# Altium schematic sheet BoardInterfaces_Sergeant.SchDoc
size Tabloid; SheetNumber: 2; SheetTotal: 6
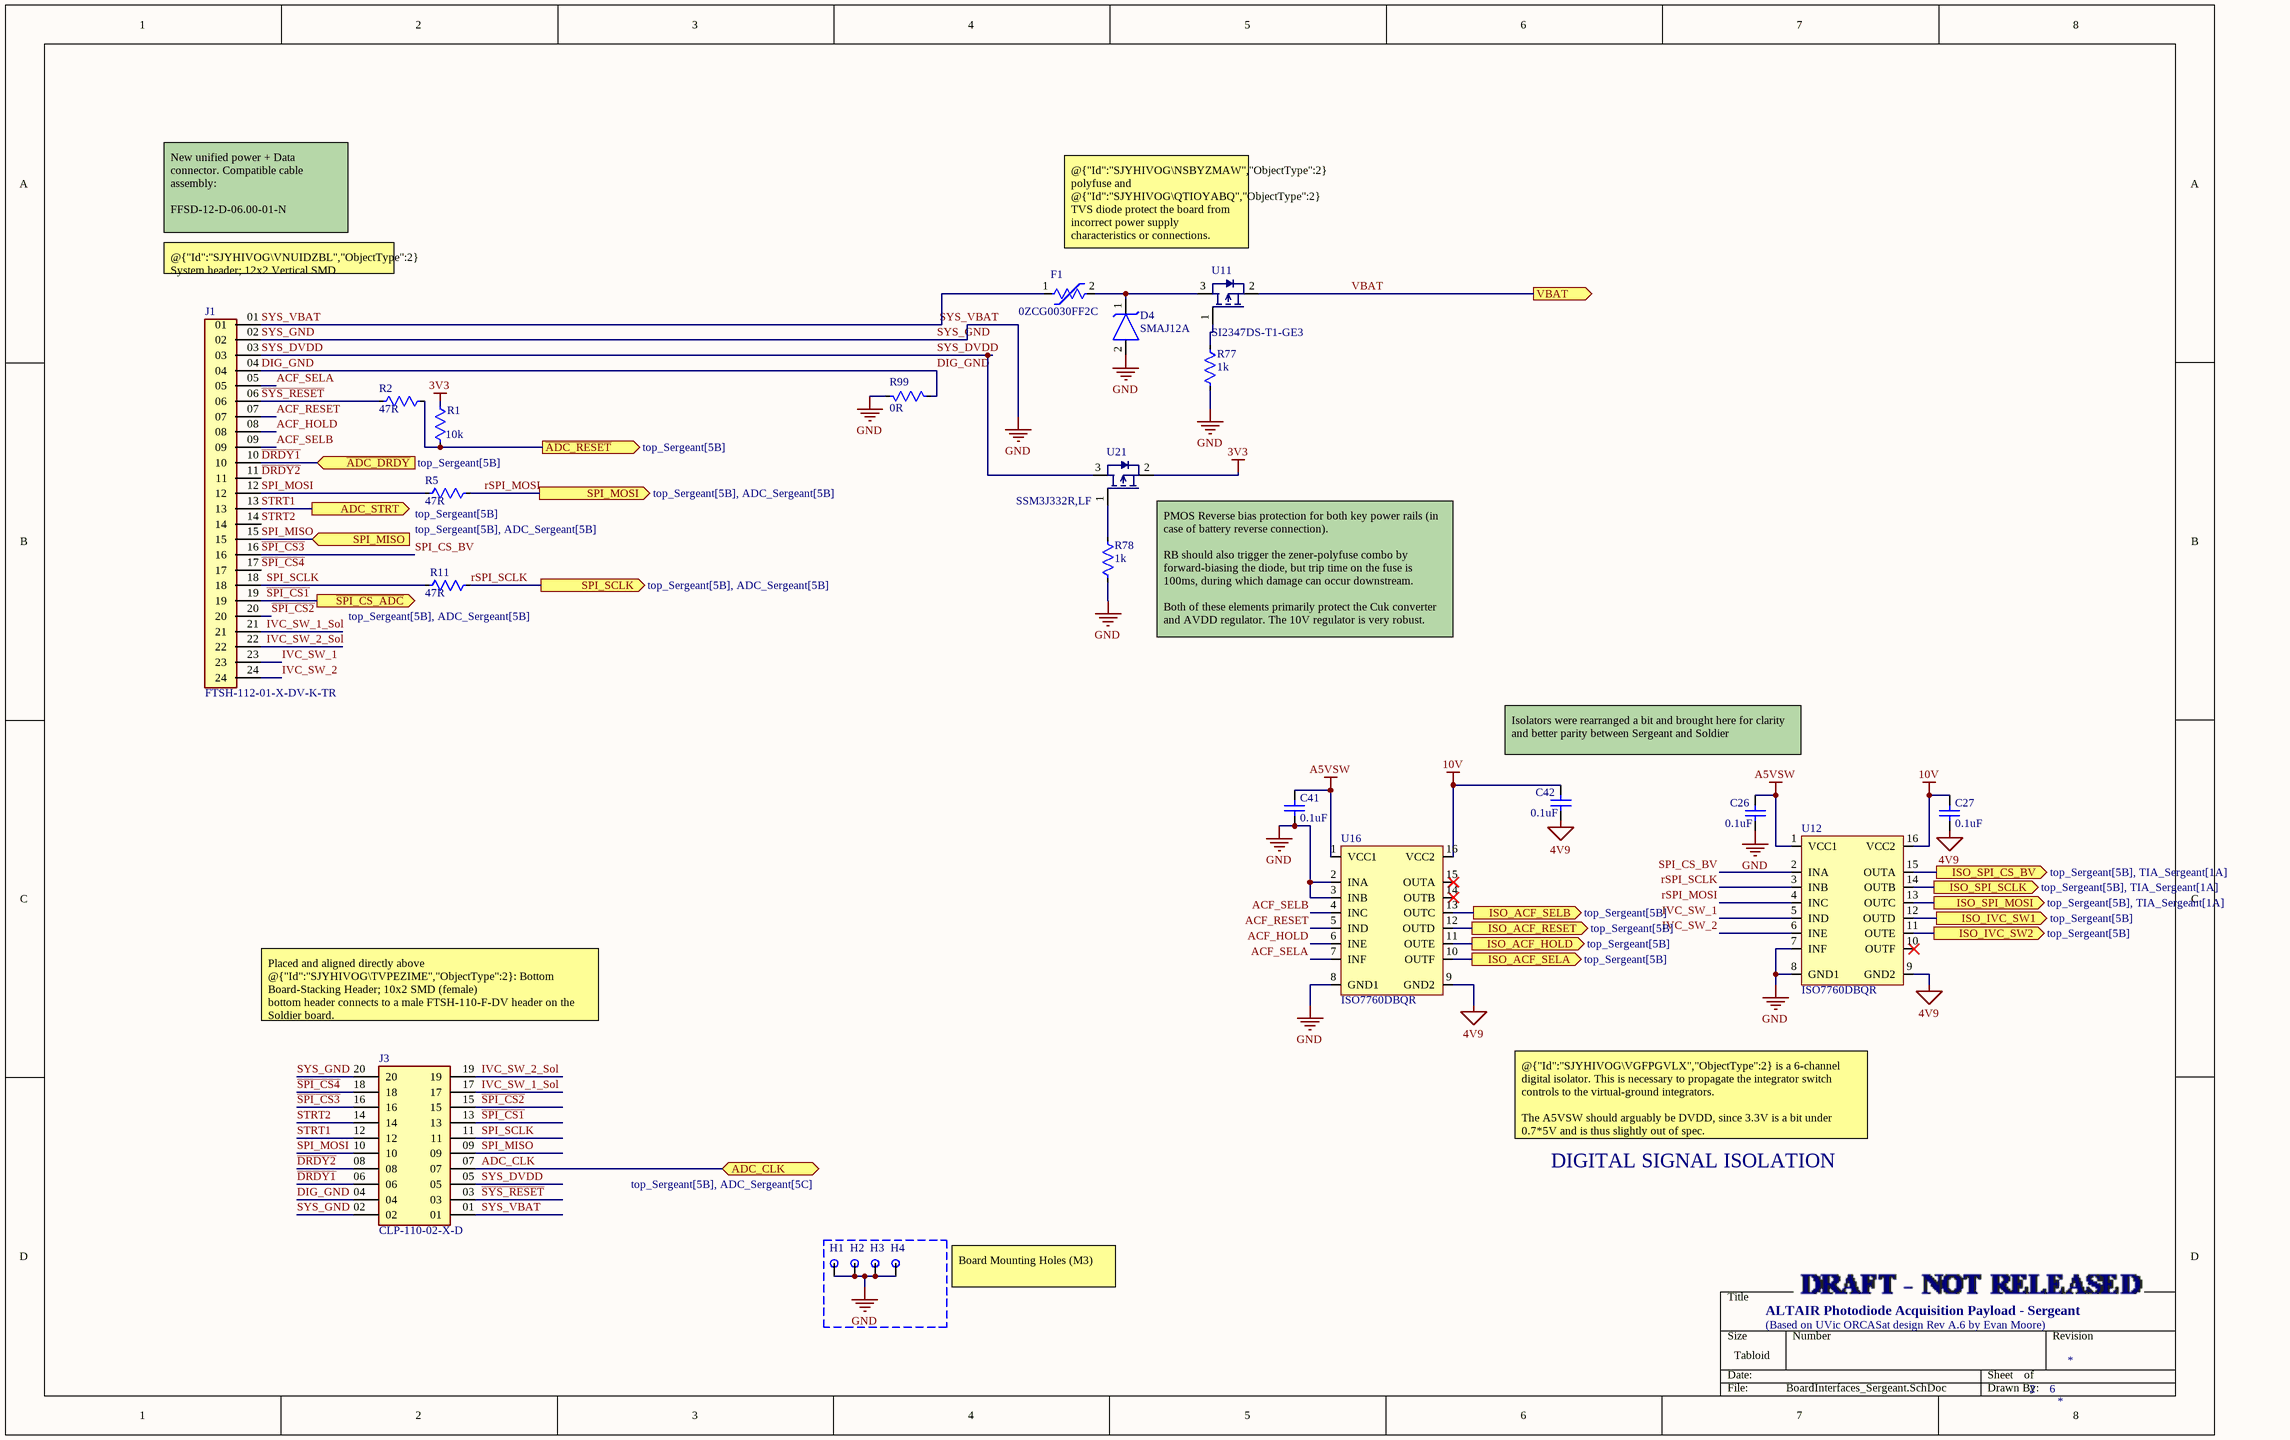
[diagram p0: BoardInterfaces_Sergeant.SchDoc]

## Parts
C26  0.1uF  [CAP 0603 IPC MID DENSITY]
C27  0.1uF  [CAP 0603 IPC MID DENSITY]
C41  0.1uF  [CAP 0603 IPC MID DENSITY]
C42  0.1uF  [CAP 0603 IPC MID DENSITY]
D4  SMAJ12A  [DO-214AC SMA VISHAY]
F1  0ZCG0030FF2C  [POLYFUSE 1812 NON-IPC BELFUSE]
H1  Mount-hole  [M3 PTH FOR 4.5MM HEX]  (value not drawn)  (no BOM)
H2  Mount-hole  [M3 PTH FOR 4.5MM HEX]  (value not drawn)  (no BOM)
H3  Mount-hole  [M3 PTH FOR 4.5MM HEX]  (value not drawn)  (no BOM)
H4  Mount-hole  [M3 PTH FOR 4.5MM HEX]  (value not drawn)  (no BOM)
J1  FTSH-112-01-X-DV-K-TR  [SAMTEC_FTSH-112-01-X-DV-K-TR]
J3  CLP-110-02-X-D  [HEADER FEMALE 10X2 1.27MM PITCH SMD]
R1  10k  [RES 0603 IPC MID DENSITY]
R2  47R  [RES 0402 NON-IPC SEI]
R5  47R  [RES 0402 NON-IPC SEI]
R11  47R  [RES 0402 NON-IPC SEI]
R77  1k  [RES 0603 IPC MID DENSITY]
R78  1k  [RES 0603 IPC MID DENSITY]
R99  0R  [RES 0402 IPC MID DENSITY]
U11  SI2347DS-T1-GE3  [SOT95P245X110-3N]
U12  ISO7760DBQR  [16-SSOP 0.635MM PITCH 5.4MM WIDTH NON-IPC TI]
U16  ISO7760DBQR  [16-SSOP 0.635MM PITCH 5.4MM WIDTH NON-IPC TI]
U21  SSM3J332R,LF  [SOT95P245X110-3N]

## Ports
ADC_CLK (bidir, see top_Sergeant[5B], ADC_Sergeant[5C]), ADC_STRT (out, see top_Sergeant[5B]), ISO_ACF_HOLD (out, see top_Sergeant[5B]), ISO_ACF_RESET (out, see top_Sergeant[5B]), ISO_ACF_SELA (out, see top_Sergeant[5B]), ISO_ACF_SELB (out, see top_Sergeant[5B]), ISO_IVC_SW1 (out, see top_Sergeant[5B]), ISO_IVC_SW2 (out, see top_Sergeant[5B]), ISO_SPI_CS_BV (out, see top_Sergeant[5B], TIA_Sergeant[1A]), ISO_SPI_MOSI (out, see top_Sergeant[5B], TIA_Sergeant[1A]), ISO_SPI_SCLK (out, see top_Sergeant[5B], TIA_Sergeant[1A]), SPI_MISO (in, see top_Sergeant[5B], ADC_Sergeant[5B]), SPI_MOSI (out, see top_Sergeant[5B], ADC_Sergeant[5B]), SPI_SCLK (out, see top_Sergeant[5B], ADC_Sergeant[5B]), VBAT (out), ~{ADC_DRDY} (in, see top_Sergeant[5B]), ~{ADC_RESET} (out, see top_Sergeant[5B]), ~{SPI_CS_ADC} (out, see top_Sergeant[5B], ADC_Sergeant[5B])

## Nets
3V3: R1.1 U21.2(Source)
4V9: C27.1 C42.1 U12.9(GND2) U16.9(GND2)
10V: C27.2 C42.2 U12.16(VCC2) U16.16(VCC2)
A5VSW: C26.2 C41.2 U12.1(VCC1) U16.1(VCC1)
SYS_GND: C26.1 C41.1 D4.2(Anode) H1.1 H2.1 H3.1 H4.1 J1.02 J3.02 J3.20 R77.1 R78.1 R99.1 U12.7(INF) U12.8(GND1) U16.2(INA) U16.3(INB) U16.8(GND1)  [also labelled GND]
~{ADC_RESET}: R1.2 R2.2 ; port ~{ADC_RESET}
~{DRDY1}: J1.10 J3.06 ; port ~{ADC_DRDY}
~{DRDY2}: J1.11 J3.08
~{SPI_CS1}: J1.19 J3.13 ; port ~{SPI_CS_ADC}
~{SPI_CS2}: J1.20 J3.15
~{SPI_CS3}: J1.16 J3.16 U12.2(INA)  [also labelled SPI_CS_BV]
~{SPI_CS4}: J1.17 J3.18
~{SYS_RESET}: J1.06 J3.03 R2.1
ACF_HOLD: J1.08 U16.6(INE)
ACF_RESET: J1.07 U16.5(IND)
ACF_SELA: J1.05 U16.7(INF)
ACF_SELB: J1.09 U16.4(INC)
ADC_CLK: J3.07 ; port ADC_CLK
DIG_GND: J1.04 J3.04 R99.2
ISO_ACF_HOLD: U16.11(OUTE) ; port ISO_ACF_HOLD
ISO_ACF_RESET: U16.12(OUTD) ; port ISO_ACF_RESET
ISO_ACF_SELA: U16.10(OUTF) ; port ISO_ACF_SELA
ISO_ACF_SELB: U16.13(OUTC) ; port ISO_ACF_SELB
ISO_IVC_SW1: U12.12(OUTD) ; port ISO_IVC_SW1
ISO_IVC_SW2: U12.11(OUTE) ; port ISO_IVC_SW2
ISO_SPI_CS_BV: U12.15(OUTA) ; port ISO_SPI_CS_BV
ISO_SPI_MOSI: U12.13(OUTC) ; port ISO_SPI_MOSI
ISO_SPI_SCLK: U12.14(OUTB) ; port ISO_SPI_SCLK
IVC_SW_1: J1.23 U12.5(IND)
IVC_SW_1_Sol: J1.21 J3.17
IVC_SW_2: J1.24 U12.6(INE)
IVC_SW_2_Sol: J1.22 J3.19
rSPI_MOSI: R5.2 U12.4(INC) ; port SPI_MOSI
rSPI_SCLK: R11.2 U12.3(INB) ; port SPI_SCLK
SPI_MISO: J1.15 J3.09 ; port SPI_MISO
SPI_MOSI: J1.12 J3.10 R5.1
SPI_SCLK: J1.18 J3.11 R11.1
STRT1: J1.13 J3.12 ; port ADC_STRT
STRT2: J1.14 J3.14
SYS_DVDD: J1.03 J3.05 U21.3(Drain)
SYS_VBAT: F1.1 J1.01 J3.01
VBAT: U11.2(Source) ; port VBAT
NetD4_1: D4.1(Cathode) F1.2 U11.3(Drain)
NetR77_2: R77.2 U11.1(Gate)
NetR78_2: R78.2 U21.1(Gate)

Not connected (* = marked no-connect by the designer): U12 10(OUTF)*; U16 14(OUTB)* 15(OUTA)*

## Notes on the sheet
- New unified power + Data connector. Compatible cable assembly:
  FFSD-12-D-06.00-01-N
- (near J1) @{"Id":"SJYHIVOG\VNUIDZBL","ObjectType":2} System header; 12x2 Vertical SMD
- @{"Id":"SJYHIVOG\NSBYZMAW","ObjectType":2} polyfuse and @{"Id":"SJYHIVOG\QTIOYABQ","ObjectType":2} TVS diode protect the board from incorrect power supply characteristics or connections.
  Rated for up to 14V and 300mA.
- (near U21) PMOS Reverse bias protection for both key power rails (in case of battery reverse connection).
  RB should also trigger the zener-polyfuse combo by forward-biasing the diode, but trip time on the fuse is 100ms, during which damage can occur downstream.
  Both of these elements primarily protect the Cuk converter and AVDD regulator. The 10V regulator is very robust.
- Isolators were rearranged a bit and brought here for clarity and better parity between Sergeant and Soldier
- Placed and aligned directly above
  @{"Id":"SJYHIVOG\TVPEZIME","ObjectType":2}: Bottom Board-Stacking Header; 10x2 SMD (female)
  bottom header connects to a male FTSH-110-F-DV header on the Soldier board.
- @{"Id":"SJYHIVOG\VGFPGVLX","ObjectType":2} is a 6-channel digital isolator. This is necessary to propagate the integrator switch controls to the virtual-ground integrators.
  The A5VSW should arguably be DVDD, since 3.3V is a bit under 0.7*5V and is thus slightly out of spec.
- DIGITAL SIGNAL ISOLATION
- Board Mounting Holes (M3)
- ALTAIR Photodiode Acquisition Payload - Sergeant
- (Based on UVic ORCASat design Rev A.6 by Evan Moore)

## Library data of the parts
C26 C27 C41 C42 = CAP: Kemet C0603C104K5RACAUTO - Cap Ceramic 0.1uF 50V X7R 10% 0603 125C Paper T/R; MF: Kemet; MP: C0603C104K5RACAUTO
D4 = Zener: Vishay SMAJ12A-M3/61 - TVS Diode 12V Standoff 13.3V Breakdown DO-214AC; MF: Vishay General Semiconductor; MP: SMAJ12A-M3/61
F1 = Polyfuse: Bel Fuse 0ZCG0030FF2C - Polymeric PTC Resettable Fuse 30V 300mA hold 600mA trip SMD 1812; MF: Bel Fuse Inc.; MP: 0ZCG0030FF2C
H1-H4 = Mount-hole: (Plated) Mounting hole
J1 = FTSH-112-01-X-DV-K-TR: MF: {'manufacturer': u'Samtec'}; Package: None; Price: None; Value: *; MP: FTSH-112-01-X-DV-K-TR; Availability: Unavailable
J3 = CLP-110-02-X-D: 10x2 Stacking Header SMD / 20 Position Receptacle Connector 0.050 (1.27mm) Surface Mount, Right Angle Gold; MF: Samtec; MP: CLP-110-02-L-D; SnapEDA_Link: https://www.snapeda.com/parts/CLP-110-02-L-D/Samtec/view-part/?ref=snap; Package: None; Value: *; Check_prices: https://www.snapeda.com/parts/CLP-110-02-L-D/Samtec/view-part/?ref=eda; System: Connector
R1 = RES: Vishay CRCW060310K0FKEA SMD 0603 10k, CRCW e3 Series, 75V, thick film, 100mW; MF: Vishay Dale; MP: CRCW060310K0FKEA
R2 R5 R11 = RES: Stackpole RMCF0402JT47R0 - Res 47Ohm 5% 0.063W 0402 Thick Film AEC-Q200 compliant; MF: Stackpole Electronics Inc.; MP: RMCF0402JT47R0
R77 R78 = RES: Panasonic ERJ-U03F1001V - Res SMD 1 kOhm 1% 1/10W 0603; MF: Panasonic Electronic Components; MP: ERJ-U03F1001V
R99 = RES: Yageo RC0402JR-070RL - Res 0 Ohms 1/16W SMD 0402; MF: YAGEO; MP: RC0402JR-070RL
U11 = PMOS: MOSFET P-CH 30V 5A SOT23-3; MF: Vishay Siliconix; Supplier 1: Avnet; Supplier Part Number 1: SI2347DS-T1-GE3; MP: SI2347DS-T1-GE3
U12 U16 = ISO7760DBQR: Digital Isolator 6-Channel 6/0 Inputs 16SSOP; MF: Texas Instruments; MP: ISO7760DBQR
U21 = PMOS_LV: P-Channel 30 V 6A (Ta) 1W (Ta) Surface Mount SOT-23F; MF: Toshiba; Supplier 1: Avnet; Supplier Part Number 1: SI2347DS-T1-GE3; MP: SSM3J332R,LF